# EAGLE schematic zasilanie (EAGLE 6.4)
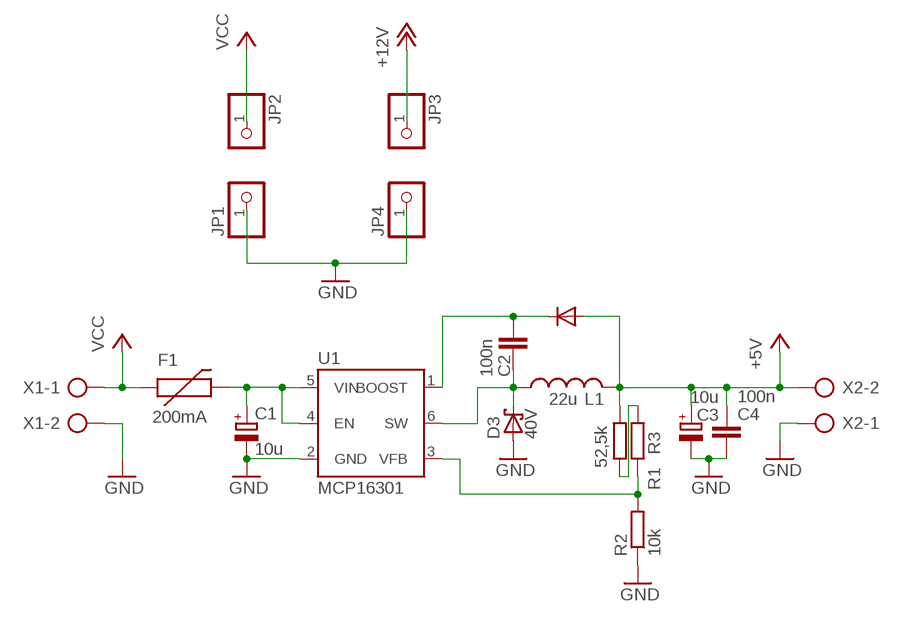
[diagram p0: schematic, sheet 1]

## Parts
C1  10u  CPOL-EUF  [PANASONIC_F]
C2  100n  C-EUC0805  [C0805]
C3  10u  CPOL-EUF  [PANASONIC_F]
C4  100n  C-EUC0805  [C0805]
D1  DIODE-SMC  [SMC]
D3  40V  SCHOTTKY-DIODESMC  [SMC]
F1  200mA  PTCSMD  [PTC-1206]
JP1  PINHD-1X1  [1X01]
JP2  PINHD-1X1  [1X01]
JP3  PINHD-1X1  [1X01]
JP4  PINHD-1X1  [1X01]
L1  22u  INDUCTORPWR  [CDRH125]
R1  52,5k  R-EU_R0805  [R0805]
R2  10k  R-EU_R0805  [R0805]
R3  R-EU_R0805  [R0805]
U1  MCP16301  MCP4725SOT-23  [SOT23-6]
X1  AK500/2  [AK500/2]
X2  AK500/2  [AK500/2]

## Nets
+5V: C3.+ C4.1 D1.A L1.2 R1.2 X2.2
+12V: JP3.1
GND: C1.- C3.- C4.2 D3.A JP1.1 JP4.1 R2.1 U1.2(GND) X1.2 X2.1
N$2: C2.1 D1.C U1.1(BOOST)
N$3: R1.1 R3.2
N$4: C2.2 D3.C L1.1 U1.6(SW)
N$6: R2.2 R3.1 U1.3(VFB)
N$7: C1.+ F1.2 U1.4(EN) U1.5(VIN)
VCC: F1.1 JP2.1 X1.1

## Library data of the parts
C1 C3 = rcl:CPOL-EU: POLARIZED CAPACITOR, European symbol
C2 C4 = rcl:C-EU: CAPACITOR, European symbol
D1 = diode:DIODE-: DIODE
D3 = diode:SCHOTTKY-DIODE: Schottky Diode
F1 = SparkFun:PTC: Resettable Fuse PTC Resettable Fuse. Spark Fun Electronics SKU : COM-08357
JP1-JP4 = pinhead:PINHD-1X1: PIN HEADER
L1 = SparkFun-Passives:INDUCTOR: Inductors Basic Inductor/Choke - 0603 and 1206. Footprints are not proven and vary greatly between part numbers. SRN6045- 33uH, 20% 1.4A SDR0403-560KL - 56uH, 10%, 500mA RMS/740mA peak
R1-R3 = rcl:R-EU_: RESISTOR, European symbol
U1 = SparkFun-AnalogIC:MCP4725: Microchip 12-bit I2C DAC, SOT23-6; PROD_ID: IC-08886; VALUE: MCP4725
X1 X2 = con-ptr500:AK500/2: CONNECTOR; OC_FARNELL: unknown; OC_NEWARK: unknown